# Altium project BOOSTController2.PrjPcb
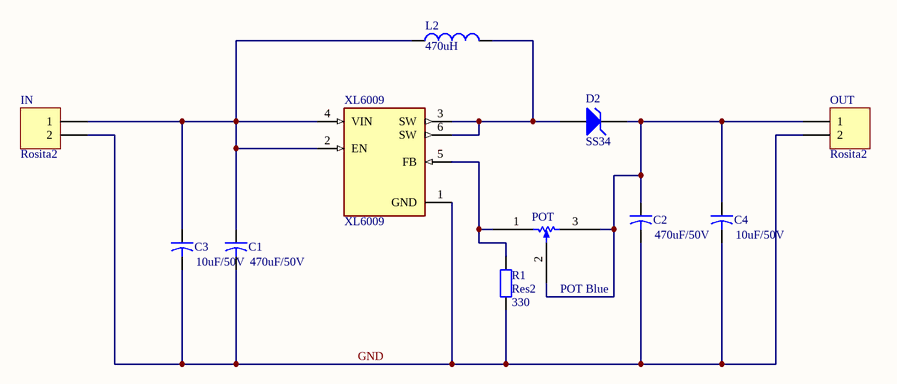
[diagram p0: BOOSTController2.SchDoc]
1 sheet, 11 parts. Net scope: global (net labels, ports and power ports of the same name join across sheets).
Board file: BOOSTController2.PcbDoc

## Sheet BOOSTController2.SchDoc
size A

### Parts
C1  value 470uF/50V  [SMC7343P]
C2  value 470uF/50V  [SMC7343P]
C3  value 10uF/50V  [SMC7343P]
C4  value 10uF/50V  [SMC7343P]
D2  SS34  [SMC]
IN  Rosita2  [Rosita2]
L2  value 470uH  [L125]
OUT  Rosita2  [Rosita2]
POT  POT Blue  [POT - Blue]
R1  Res2  value 330  [AXIAL-0.4]
XL6009  XL6009  [XL6009]

### Nets
GND: C1.2 C2.2 C3.2 C4.2 IN.2 OUT.2 R1.1 XL6009.1(GND)
NetC1_1: C1.1 C3.1 IN.1 L2.1 XL6009.2(EN) XL6009.4(VIN)
NetC2_1: C2.1 C4.1 D2.2(K) OUT.1 POT.2 POT.3
NetD2_1: D2.1(A) L2.2 XL6009.3(SW) XL6009.6(SW)
NetPOT_1: POT.1 R1.2 XL6009.5(FB)

### Library data of the parts
C1-C4 = Cap2: Capacitor; Published: 23-Sep-2002; PackageReference: CAPR5-4X5; Publisher: Altium Limited; PackageDescription: Capacitor; 2 Leads
D2 = D Zener: Schottky Diode [SS34]; Published: 8-Jun-2000; LatestRevisionDate: 17-Jul-2002; LatestRevisionNote: Re-released for DXP Platform.; PackageReference: DIODE-0.7; Publisher: Altium Limited; PackageDescription: Diode, Thru-Hole; 2 Leads; 0.7 in Pin Spacing
L2 = Inductor: Code_IEC: 1005; Published: 8-Jun-2000; LatestRevisionDate: 29-May-2009; LatestRevisionNote: IPC-7351 Footprint Added.; PackageReference: 0402-A; Publisher: Altium Limited; PackageDescription: Chip Inductor; Code_JEITA: 0402
R1 = Res2: Resistor; Published: 8-Jun-2000; LatestRevisionDate: 17-Jul-2002; LatestRevisionNote: Re-released for DXP Platform.; PackageReference: AXIAL-0.4; Publisher: Altium Limited; PackageDescription: Axial Device, Thru-Hole; 2 Leads; 0.4 in Pin Spacing